# Altium schematic sheet Diff Pair Final FPGA Compatible MIPI D-PHY Adapter Board.SchDoc
size D; SheetNumber: 1; SheetTotal: 1
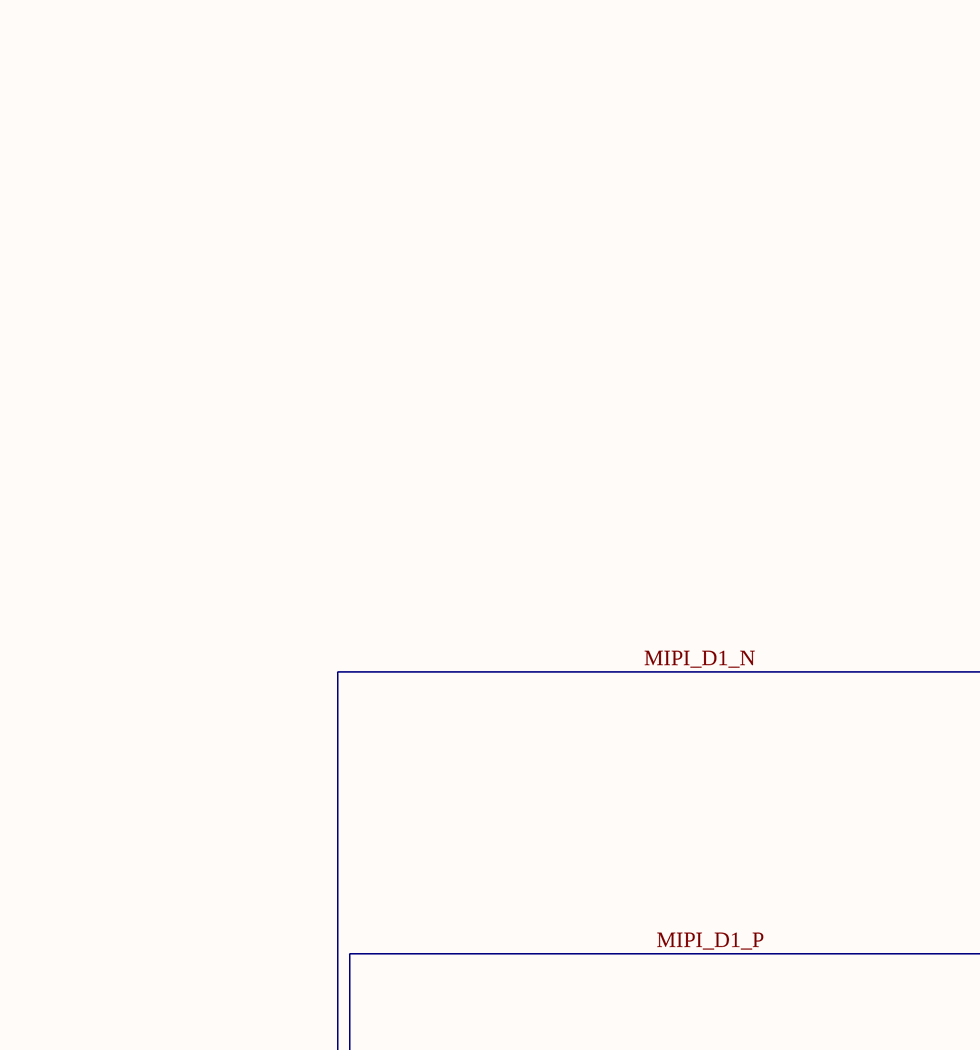
[diagram p0: Diff Pair Final FPGA Compatible MIPI D-PHY Adapter Board.SchDoc, top left]
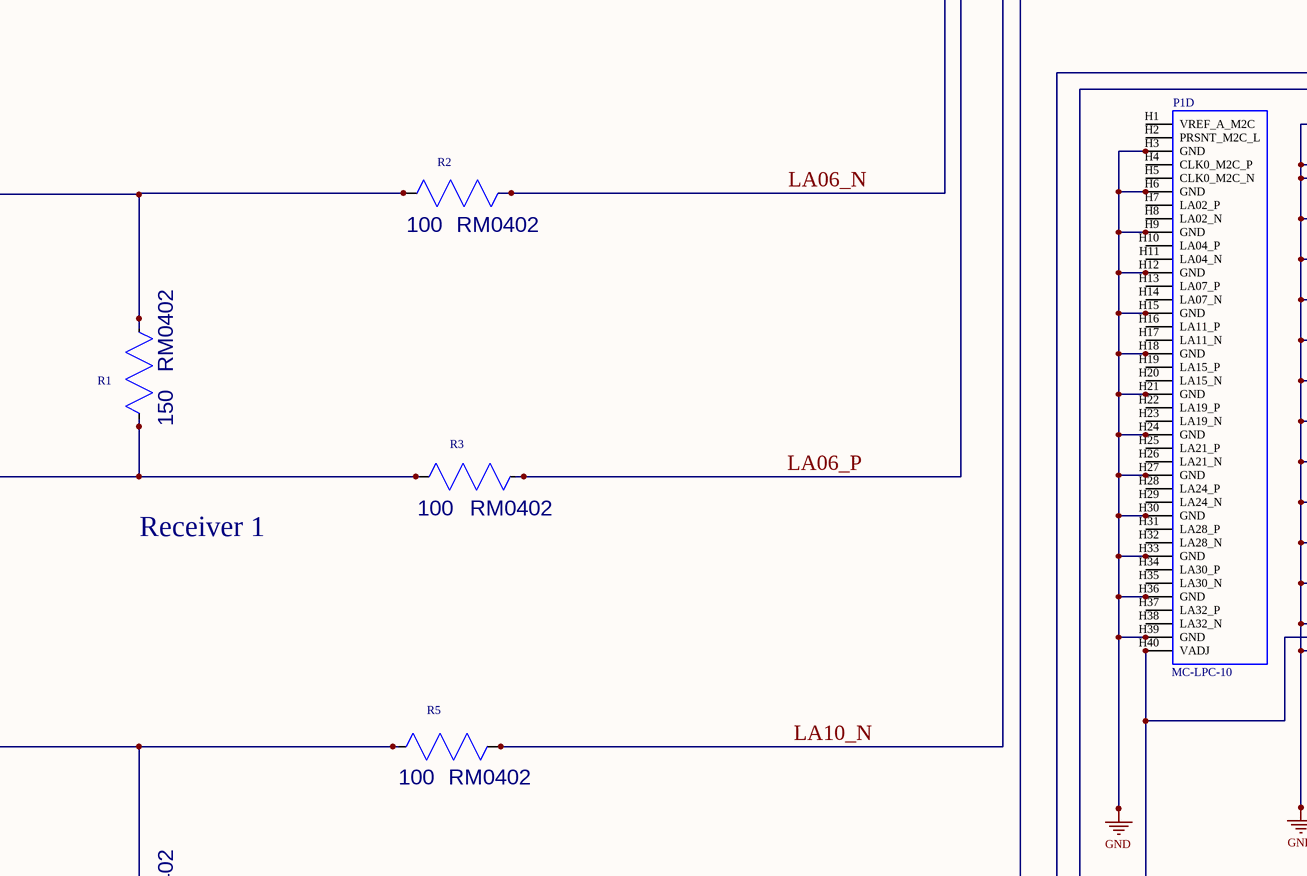
[diagram p1: Diff Pair Final FPGA Compatible MIPI D-PHY Adapter Board.SchDoc, top middle]
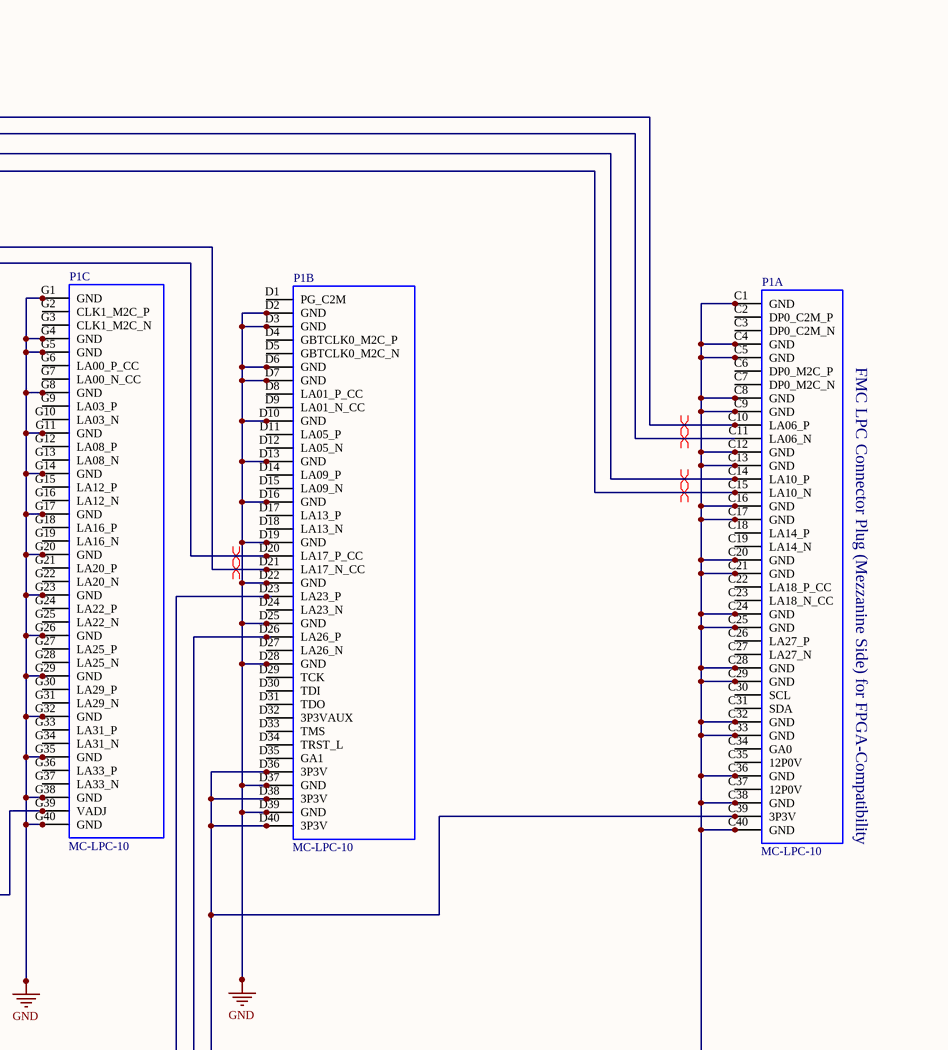
[diagram p2: Diff Pair Final FPGA Compatible MIPI D-PHY Adapter Board.SchDoc, top right]
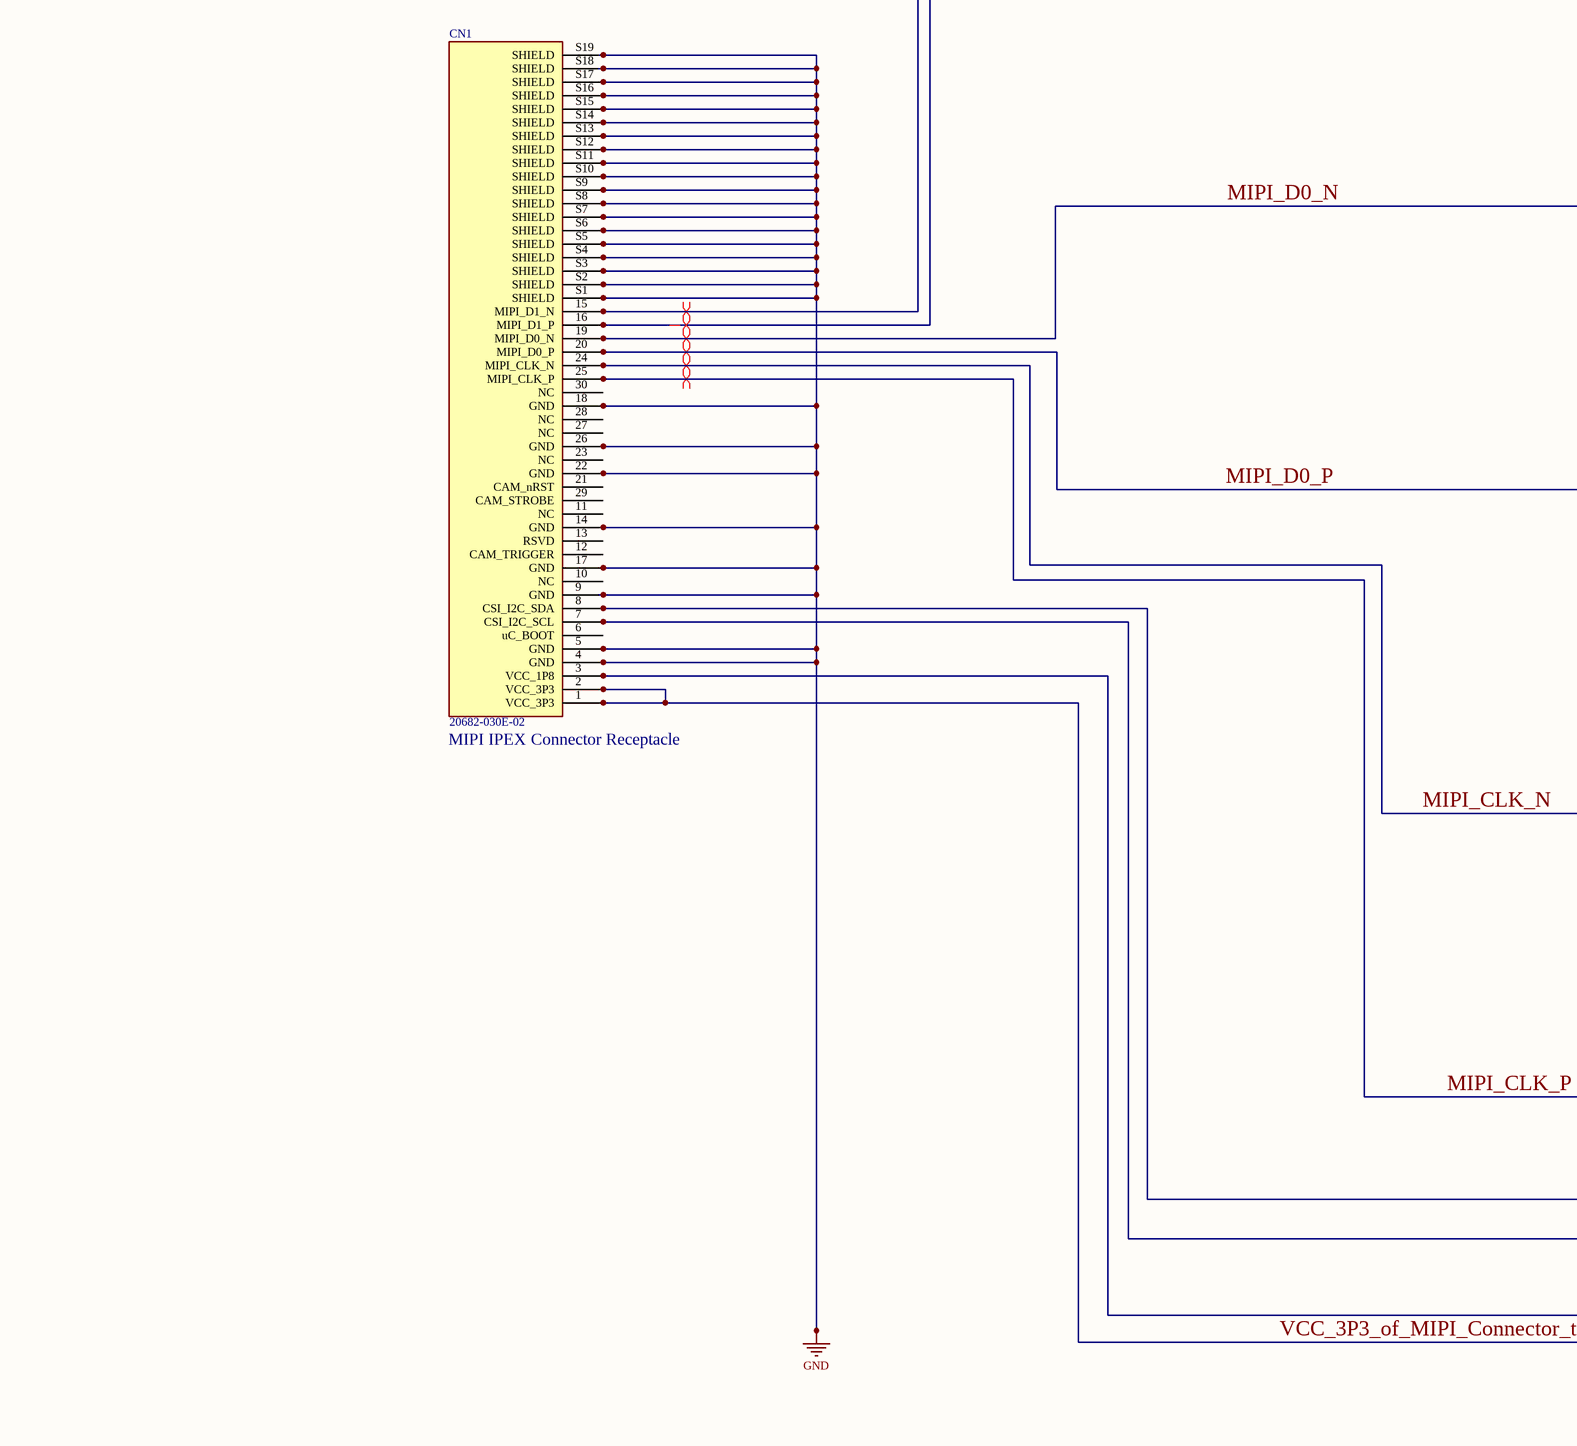
[diagram p3: Diff Pair Final FPGA Compatible MIPI D-PHY Adapter Board.SchDoc, bottom left]
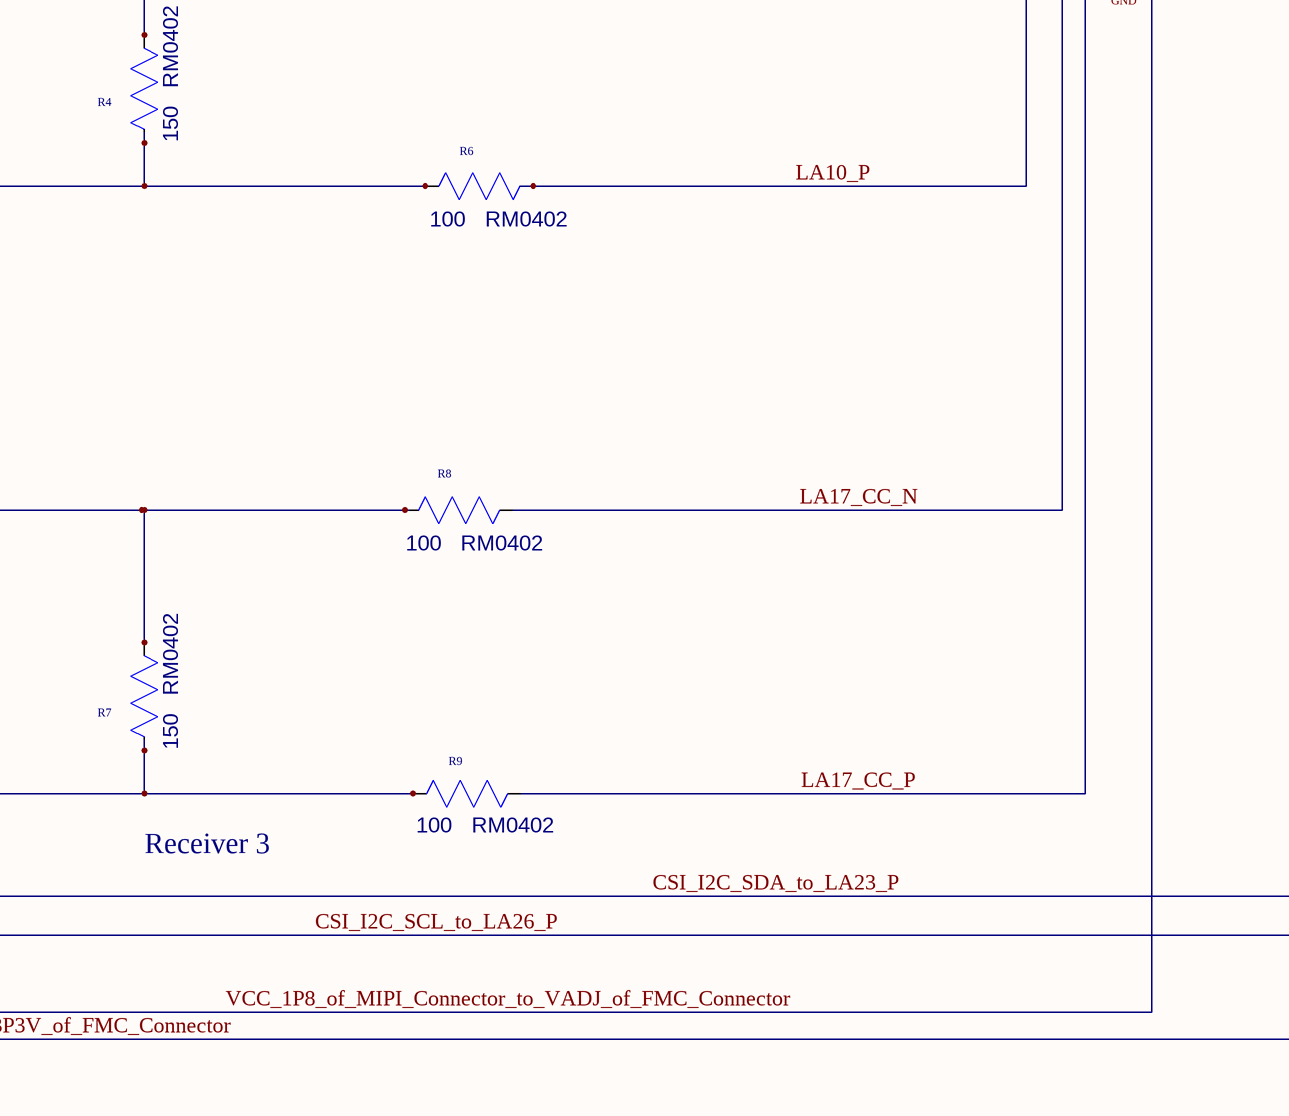
[diagram p4: Diff Pair Final FPGA Compatible MIPI D-PHY Adapter Board.SchDoc, bottom middle]
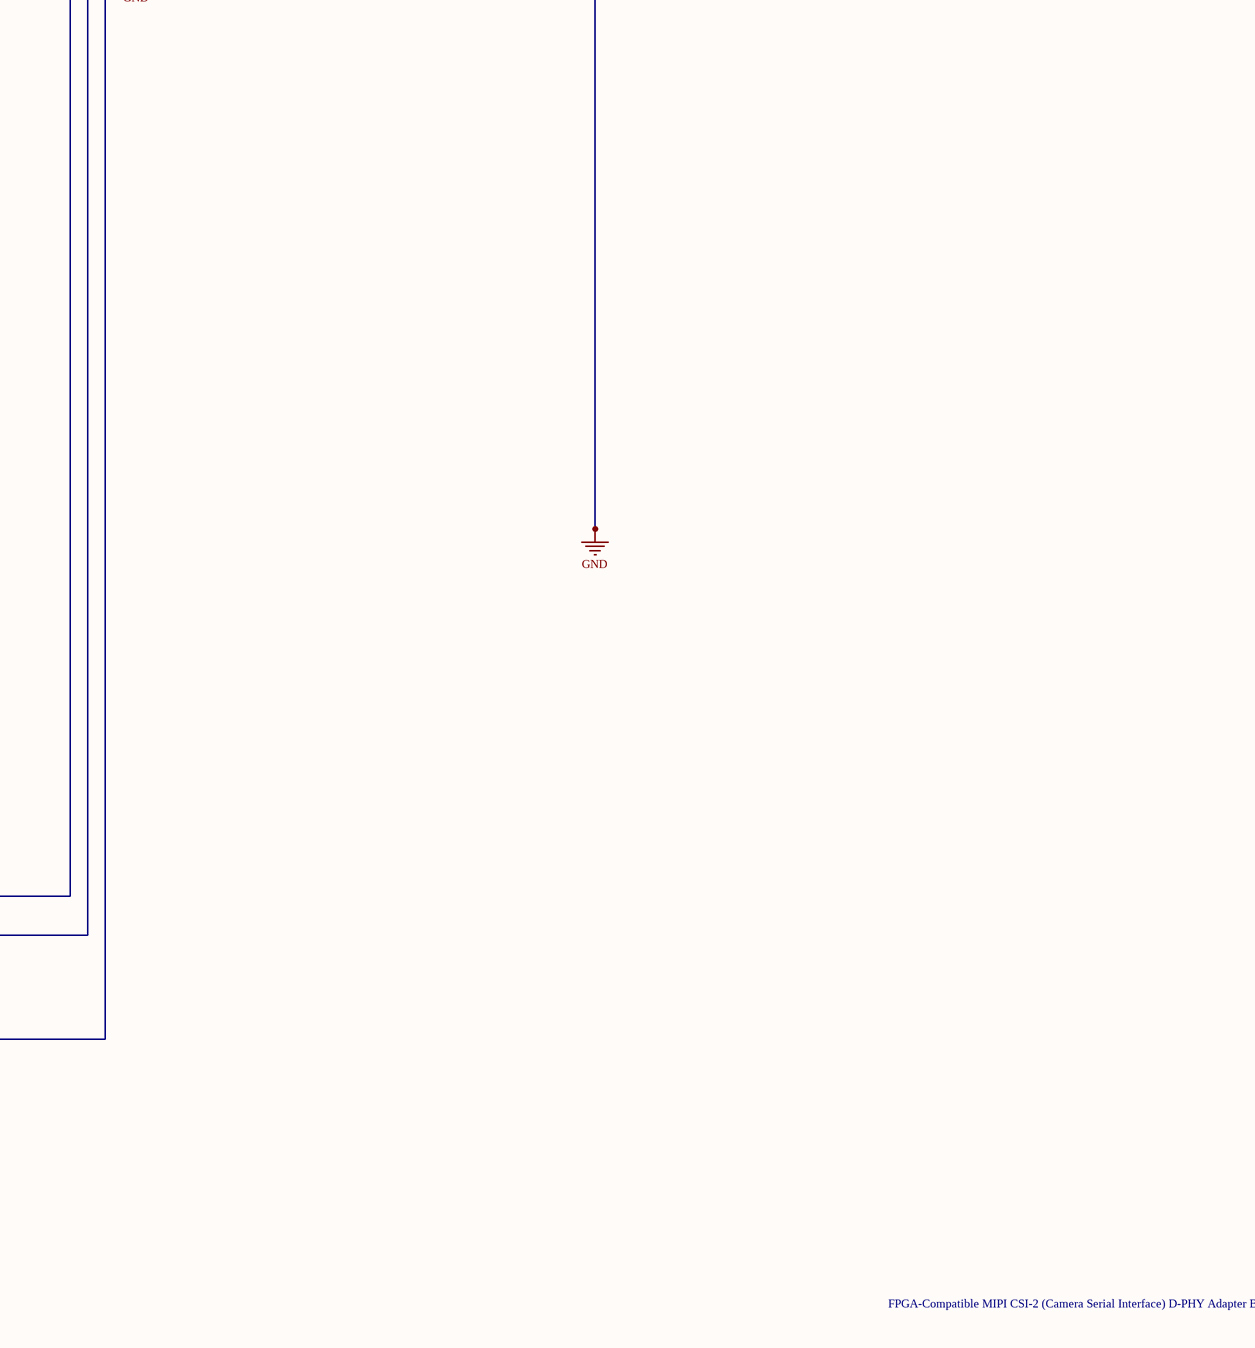
[diagram p5: Diff Pair Final FPGA Compatible MIPI D-PHY Adapter Board.SchDoc, bottom right]

## Parts
CN1  20682-030E-02  [20682-030E-02]
P1  MC-LPC-10  [MC-LPC-10]  (parts A,B,C,D of 4)
R1  CH0402-150RGFPA  [R0402]  (value not drawn)
R2  value 100  PKG_TYPE: RM0402  [R0402]  (hidden comment: M55342H11B100DR)
R3  value 100  PKG_TYPE: RM0402  [R0402]  (hidden comment: M55342H11B100DR)
R4  CH0402-150RGFPA  [R0402]  (value not drawn)
R5  value 100  PKG_TYPE: RM0402  [R0402]  (hidden comment: M55342H11B100DR)
R6  value 100  PKG_TYPE: RM0402  [R0402]  (hidden comment: M55342H11B100DR)
R7  CH0402-150RGFPA  [R0402]  (value not drawn)
R8  value 100  PKG_TYPE: RM0402  [R0402]  (hidden comment: M55342H11B100DR)
R9  value 100  PKG_TYPE: RM0402  [R0402]  (hidden comment: M55342H11B100DR)

## Nets
GND: CN1.4(GND) CN1.5(GND) CN1.9(GND) CN1.14(GND) CN1.17(GND) CN1.18(GND) CN1.22(GND) CN1.26(GND) CN1.S1(SHIELD) CN1.S2(SHIELD) CN1.S3(SHIELD) CN1.S4(SHIELD) CN1.S5(SHIELD) CN1.S6(SHIELD) CN1.S7(SHIELD) CN1.S8(SHIELD) CN1.S9(SHIELD) CN1.S10(SHIELD) CN1.S11(SHIELD) CN1.S12(SHIELD) CN1.S13(SHIELD) CN1.S14(SHIELD) CN1.S15(SHIELD) CN1.S16(SHIELD) CN1.S17(SHIELD) CN1.S18(SHIELD) CN1.S19(SHIELD) P1.C1(GND) P1.C4(GND) P1.C5(GND) P1.C8(GND) P1.C9(GND) P1.C12(GND) P1.C13(GND) P1.C16(GND) P1.C17(GND) P1.C20(GND) P1.C21(GND) P1.C24(GND) P1.C25(GND) P1.C28(GND) P1.C29(GND) P1.C32(GND) P1.C33(GND) P1.C36(GND) P1.C38(GND) P1.C40(GND) P1.D2(GND) P1.D3(GND) P1.D6(GND) P1.D7(GND) P1.D10(GND) P1.D13(GND) P1.D16(GND) P1.D19(GND) P1.D22(GND) P1.D25(GND) P1.D28(GND) P1.D37(GND) P1.D39(GND) P1.G1(GND) P1.G4(GND) P1.G5(GND) P1.G8(GND) P1.G11(GND) P1.G14(GND) P1.G17(GND) P1.G20(GND) P1.G23(GND) P1.G26(GND) P1.G29(GND) P1.G32(GND) P1.G35(GND) P1.G38(GND) P1.G40(GND) P1.H3(GND) P1.H6(GND) P1.H9(GND) P1.H12(GND) P1.H15(GND) P1.H18(GND) P1.H21(GND) P1.H24(GND) P1.H27(GND) P1.H30(GND) P1.H33(GND) P1.H36(GND) P1.H39(GND)
CSI_I2C_SCL_to_LA26_P: CN1.7(CSI_I2C_SCL) P1.D26(LA26_P)
CSI_I2C_SDA_to_LA23_P: CN1.8(CSI_I2C_SDA) P1.D23(LA23_P)
LA06_N: P1.C11(LA06_N) R2.2
LA06_P: P1.C10(LA06_P) R3.2
LA10_N: P1.C15(LA10_N) R5.2
LA10_P: P1.C14(LA10_P) R6.2
LA17_CC_N: P1.D21(LA17_N_CC) R8.2
LA17_CC_P: P1.D20(LA17_P_CC) R9.2
MIPI_CLK_N: CN1.24(MIPI_CLK_N) R7.2 R8.1
MIPI_CLK_P: CN1.25(MIPI_CLK_P) R7.1 R9.1
MIPI_D0_N: CN1.19(MIPI_D0_N) R4.2 R5.1
MIPI_D0_P: CN1.20(MIPI_D0_P) R4.1 R6.1
MIPI_D1_N: CN1.15(MIPI_D1_N) R1.2 R2.1
MIPI_D1_P: CN1.16(MIPI_D1_P) R1.1 R3.1
VCC_1P8_of_MIPI_Connector_to_VADJ_of_FMC_Connector: CN1.3(VCC_1P8) P1.G39(VADJ) P1.H40(VADJ)
VCC_3P3_of_MIPI_Connector_to_3P3V_of_FMC_Connector: CN1.1(VCC_3P3) CN1.2(VCC_3P3) P1.C39(3P3V) P1.D36(3P3V) P1.D38(3P3V) P1.D40(3P3V)

Not connected (* = marked no-connect by the designer): CN1 6(uC_BOOT) 10(NC) 11(NC) 12(CAM_TRIGGER) 13(RSVD) 21(CAM_nRST) 23(NC) 27(NC) 28(NC) 29(CAM_STROBE) 30(NC); P1 C2(DP0_C2M_P) C3(DP0_C2M_N) C6(DP0_M2C_P) C7(DP0_M2C_N) C18(LA14_P) C19(LA14_N) C22(LA18_P_CC) C23(LA18_N_CC) C26(LA27_P) C27(LA27_N) C30(SCL) C31(SDA) C34(GA0) C35(12P0V) C37(12P0V) D1(PG_C2M) D4(GBTCLK0_M2C_P) D5(GBTCLK0_M2C_N) D8(LA01_P_CC) D9(LA01_N_CC) D11(LA05_P) D12(LA05_N) D14(LA09_P) D15(LA09_N) D17(LA13_P) D18(LA13_N) D24(LA23_N) D27(LA26_N) D29(TCK) D30(TDI) D31(TDO) D32(3P3VAUX) D33(TMS) D34(TRST_L) D35(GA1) G2(CLK1_M2C_P) G3(CLK1_M2C_N) G6(LA00_P_CC) G7(LA00_N_CC) G9(LA03_P) G10(LA03_N) G12(LA08_P) G13(LA08_N) G15(LA12_P) G16(LA12_N) G18(LA16_P) G19(LA16_N) G21(LA20_P) G22(LA20_N) G24(LA22_P) G25(LA22_N) G27(LA25_P) G28(LA25_N) G30(LA29_P) G31(LA29_N) G33(LA31_P) G34(LA31_N) G36(LA33_P) G37(LA33_N) H1(VREF_A_M2C) H2(PRSNT_M2C_L) H4(CLK0_M2C_P) H5(CLK0_M2C_N) H7(LA02_P) H8(LA02_N) H10(LA04_P) H11(LA04_N) H13(LA07_P) H14(LA07_N) H16(LA11_P) H17(LA11_N) H19(LA15_P) H20(LA15_N) H22(LA19_P) H23(LA19_N) H25(LA21_P) H26(LA21_N) H28(LA24_P) H29(LA24_N) H31(LA28_P) H32(LA28_N) H34(LA30_P) H35(LA30_N) H37(LA32_P) H38(LA32_N)

## Layout directives
differential pair; differential pair class FMCDIFF: LA06_N, LA06_P, LA10_N, LA10_P, LA17_CC_N, LA17_CC_P
differential pair; differential pair class MIPIDIFF: MIPI_CLK_N, MIPI_CLK_P, MIPI_D0_N, MIPI_D0_P, MIPI_D1_N, MIPI_D1_P

## Notes on the sheet
- FMC LPC Connector Plug (Mezzanine Side) for FPGA-Compatibility
- Receiver 1
- (near CN1) MIPI IPEX Connector Receptacle
- Receiver 3
- FPGA-Compatible MIPI CSI-2 (Camera Serial Interface) D-PHY Adapter Board, NASA

## Library data of the parts
CN1 = 20682-030E-02: I-PEX Connector Receptacle. 0.4 mm pitch, Horizontal mating type Micro-coaxial connector with EMI shielding cover and mechanical lock. MIPI-Compatible.; MF: I-PEX; Value: *; Package: None; Availability: Unavailable; Price: None; SnapEDA_Link: https://www.snapeda.com/parts/20682-030E-02/I-PEX/view-part/3220275/?ref=snap; PROTO_VEN_PN: 20682-030E-02; PROTO_VEN: I-PEX; PROTO_MFG: I-PEX; PROTO_MFG_PN: 20682-030E-02
P1 = MC-LPC-10_1: MC-LPC-10, FMC Low-pin count connector, lead free, 160 I/Os, male, 10 mm mated stack height; Manufacturer Ref: SEAM-40-03.5-S-10-2-A-K-TR-VITA57; PROTO_MFG: SAMTEC; PROTO_MFG_PN: ASP-134604-01; Pitch: 1.27 mm; Mated Stack Height: 10 mm; Solder Type: Lead-Free; Number I/O: 160; PROTO_VENDOR: DIGIKEY; PROTO_VENDOR_PN: SAM8732-ND; Part: ASP-134604-01; Vita PartNumber: MC-LPC-10; Pin Count: Low; Gender: male
R1 R4 R7 = RES_146: Resistor; PKG_TYPE: RM0402; VALUE: 150; POWER: 0.05; PROTO_MFG: VISHAY; PROTO_VENDOR: DIGIKEY; NOTES: RES SMD 150Ohm 1/20W  0402 Package Type; TOLERANCE: 2.0%; DEVICE: RES_146; PROTO_MFG_PN: CH0402-150RGFPA; FLIGHT_MFG_PN: CH0402-150RGFPA; MOUNTING: SMD
R2 = RES_014: Resistor, 100Ohms; TOLERANCE: 1.0%; POWER: 0.04; PROTO_MFG_PN: ERJ-2RKF1000X; PROTO_MFG: PANASONIC; PROTO_VENDOR: DIGIKEY; PROTO_VENDOR_PN: P100LCT-ND; NOTES: RES 100 OHM 40mW 1% 0402 SMD; PROTO_COST: 0.1; FLIGHT_COST: 1; FLIGHT_MFG_PN: M55342H11B100DR; FLIGHT_MFG: *; DEVICE: RES_014; MOUNTING: SMD
R3 R5 R6 R8 R9 = RES_014: Resistor; TOLERANCE: 1.0%; POWER: 0.04; PROTO_MFG_PN: ERJ-2RKF1000X; PROTO_MFG: PANASONIC; PROTO_VENDOR: DIGIKEY; PROTO_VENDOR_PN: P100LCT-ND; NOTES: RES 100 OHM 40mW 1% 0402 SMD; PROTO_COST: 0.1; FLIGHT_COST: 1; FLIGHT_MFG_PN: M55342H11B100DR; FLIGHT_MFG: *; DEVICE: RES_014; MOUNTING: SMD